# EAGLE schematic ChargerModule (EAGLE 6.4)
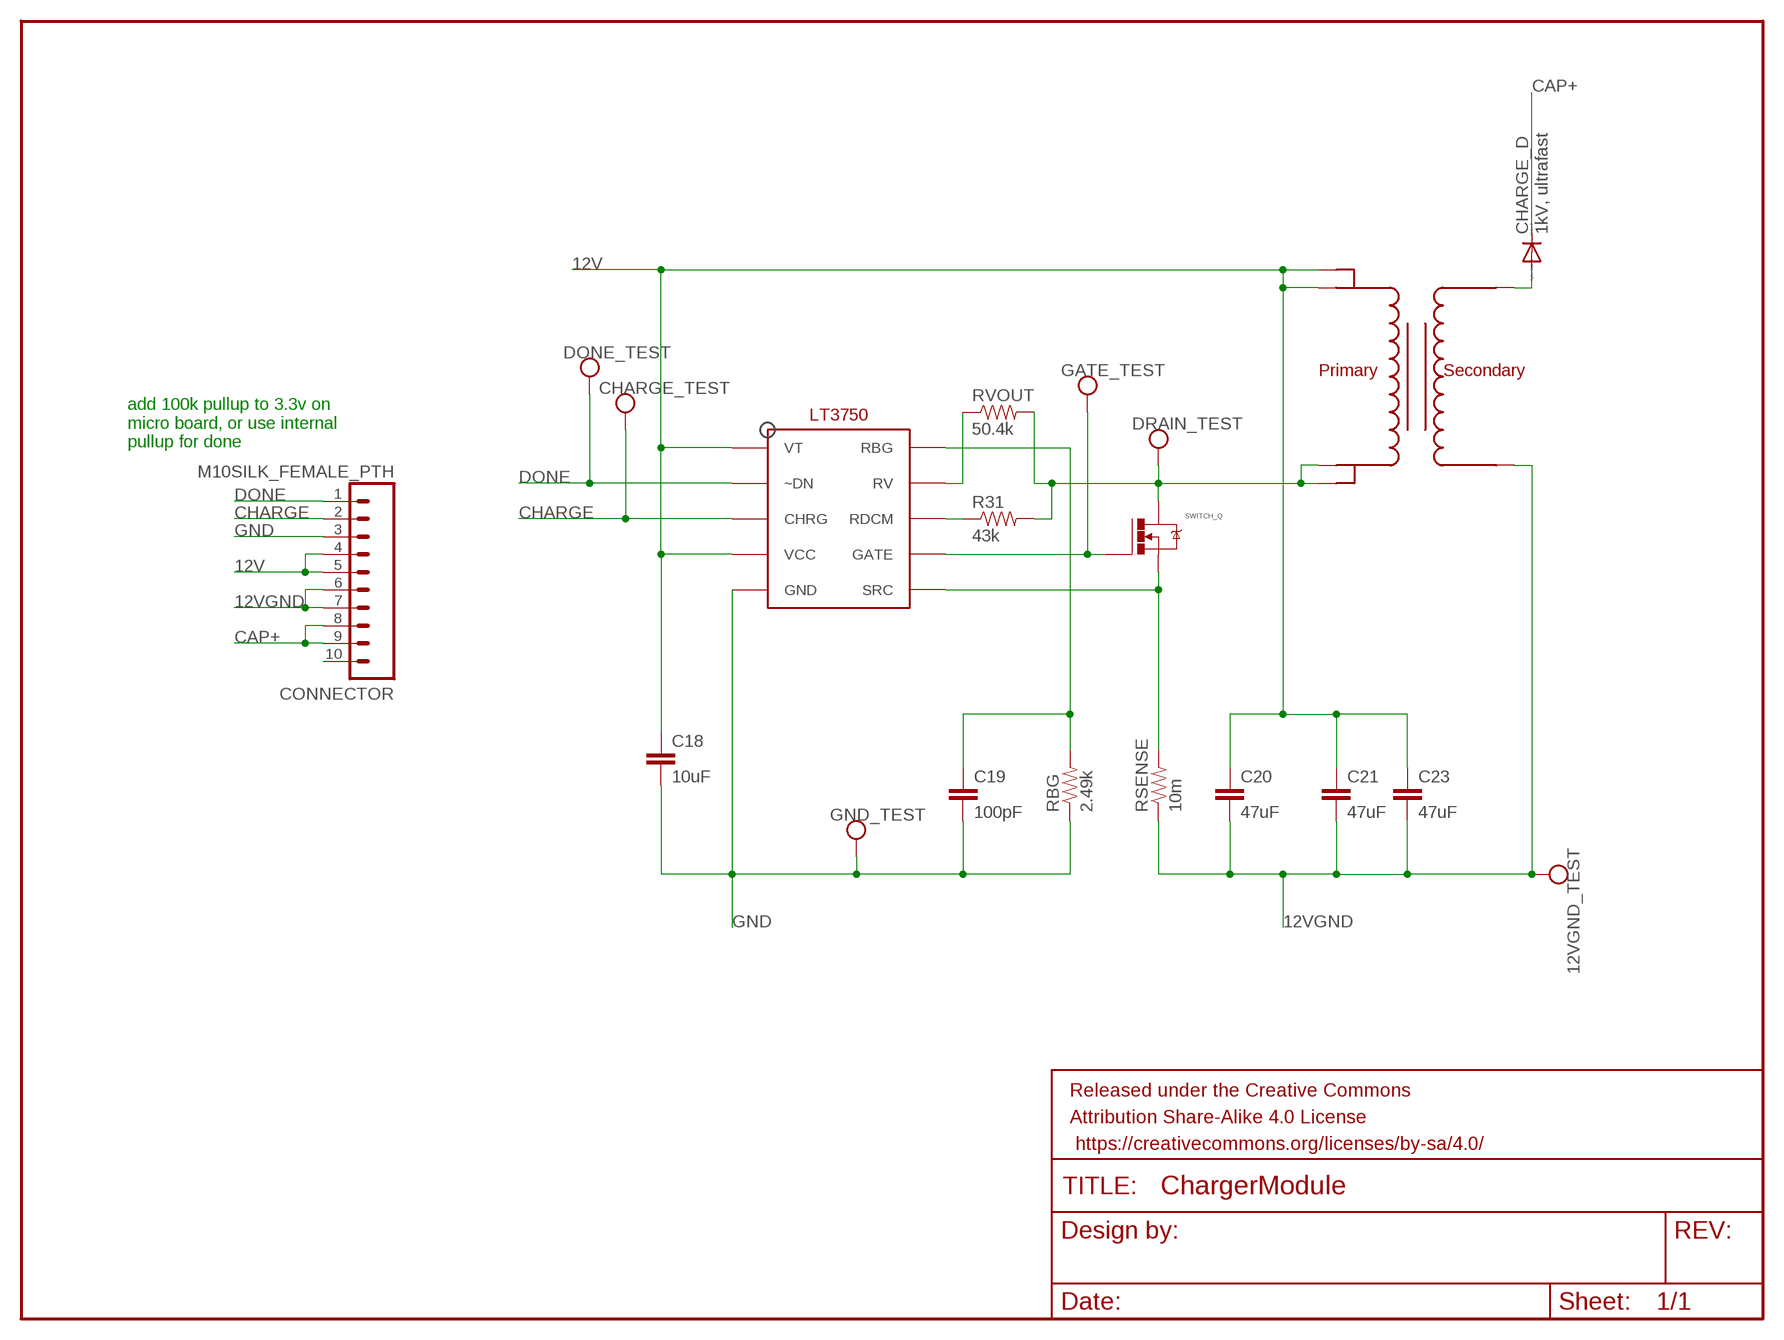
[diagram p0: schematic, sheet 1]

## Parts
12VGND_TEST  TEST_PT  [TESTING_PT]
C18  10uF  CAP0805  [0805]
C19  100pF  CAP0805  [0805]
C20  47uF  CAP1206  [1206]
C21  47uF  CAP1206  [1206]
C23  47uF  CAP1206  [1206]
CHARGE_D  1kV, ultrafast  DIODE-DO214AC  [DO214AC]
CHARGE_TEST  TEST_PT  [TESTING_PT]
CHARGE_U  LT3750  [10-MSOP]
CONNECTOR  M10SILK_FEMALE_PTH  [1X10]
DONE_TEST  TEST_PT  [TESTING_PT]
DRAIN_TEST  TEST_PT  [TESTING_PT]
FRAME3  FRAME-LETTER  [CREATIVE_COMMONS]
GATE_TEST  TEST_PT  [TESTING_PT]
GND_TEST  TEST_PT  [TESTING_PT]
R31  43k  RESISTOR0805-RES  [0805]
RBG  2.49k  RESISTOR0805-RES  [0805]
RSENSE  10m  RESISTOR2512  [R2512]
RVOUT  50.4k  RESISTOR0805-RES  [0805]
SWITCH_Q  N-MOSFETDPAK  [DPAK]
U$1  32052-TRANSFORMER  [10-TRANSFORMER]

## Nets
12V: C18.1 C20.1 C21.1 C23.1 CHARGE_U.P$1(VT) CHARGE_U.P$4(VCC) CONNECTOR.4 CONNECTOR.5 U$1.P$4 U$1.P$5
12VGND: 12VGND_TEST.P$1 C20.2 C21.2 C23.2 CONNECTOR.6 CONNECTOR.7 RSENSE.1 U$1.P$10
CAP+: CHARGE_D.C CONNECTOR.8 CONNECTOR.9
CHARGE: CHARGE_TEST.P$1 CHARGE_U.P$3(CHRG) CONNECTOR.2
DONE: CHARGE_U.P$2(~DN) CONNECTOR.1 DONE_TEST.P$1
GND: C18.2 C19.2 CHARGE_U.P$5(GND) CONNECTOR.3 GND_TEST.P$1 RBG.1
N$5: DRAIN_TEST.P$1 R31.2 RVOUT.2 SWITCH_Q.DRAIN(D) U$1.P$6 U$1.P$7
N$6: C19.1 CHARGE_U.P$10(RBG) RBG.2
N$7: CHARGE_U.P$9(RV) RVOUT.1
N$9: CHARGE_U.P$7(GATE) GATE_TEST.P$1 SWITCH_Q.GATE(G)
N$10: CHARGE_U.P$8(RDCM) R31.1
N$24: CHARGE_U.P$6(SRC) RSENSE.2 SWITCH_Q.SOURCE(S)
TRANS_OUT: CHARGE_D.A U$1.P$1
Unconnected: CONNECTOR.10

## Notes on the sheet
- add 100k pullup to 3.3v on 
  micro board, or use internal 
  pullup for done

## Library data of the parts
12VGND_TEST CHARGE_TEST DONE_TEST DRAIN_TEST GATE_TEST GND_TEST = gen3:TEST_PT: Testing Point Use to probe a signal
C18-C21 C23 = SparkFun-Capacitors:CAP: Capacitor Standard 0603 ceramic capacitor, and 0.1" leaded capacitor.
CHARGE_D = gen3:DIODE-: DIODE
CHARGE_U = kickerchips:LT3750
CONNECTOR = SparkFun-Connectors:M10: Header 10 Standard 10-pin 0.1" header. Use with straight break away headers (SKU : PRT-00116), right angle break away headers (PRT-00553), swiss pins (PRT-00743), machine pins (PRT-00117), and female headers (PRT-00115).; PROD_ID: CONN-11563
FRAME3 = SparkFun-Aesthetics:FRAME-LETTER: Schematic Frame Standard 8.5x11 US Letter frame
R31 RBG RSENSE RVOUT = SparkFun-Passives:RESISTOR: Resistor Basic schematic elements and footprints for 0603, 1206, and PTH resistors.
SWITCH_Q = gen3:N-MOSFET: N-Channel Power Mosfet
U$1 = gen3:32052-TRANSFORMER: 32052 flyback transformer digikey #: 732-2129-1-ND